# EAGLE design main (EAGLE 9.6.2)
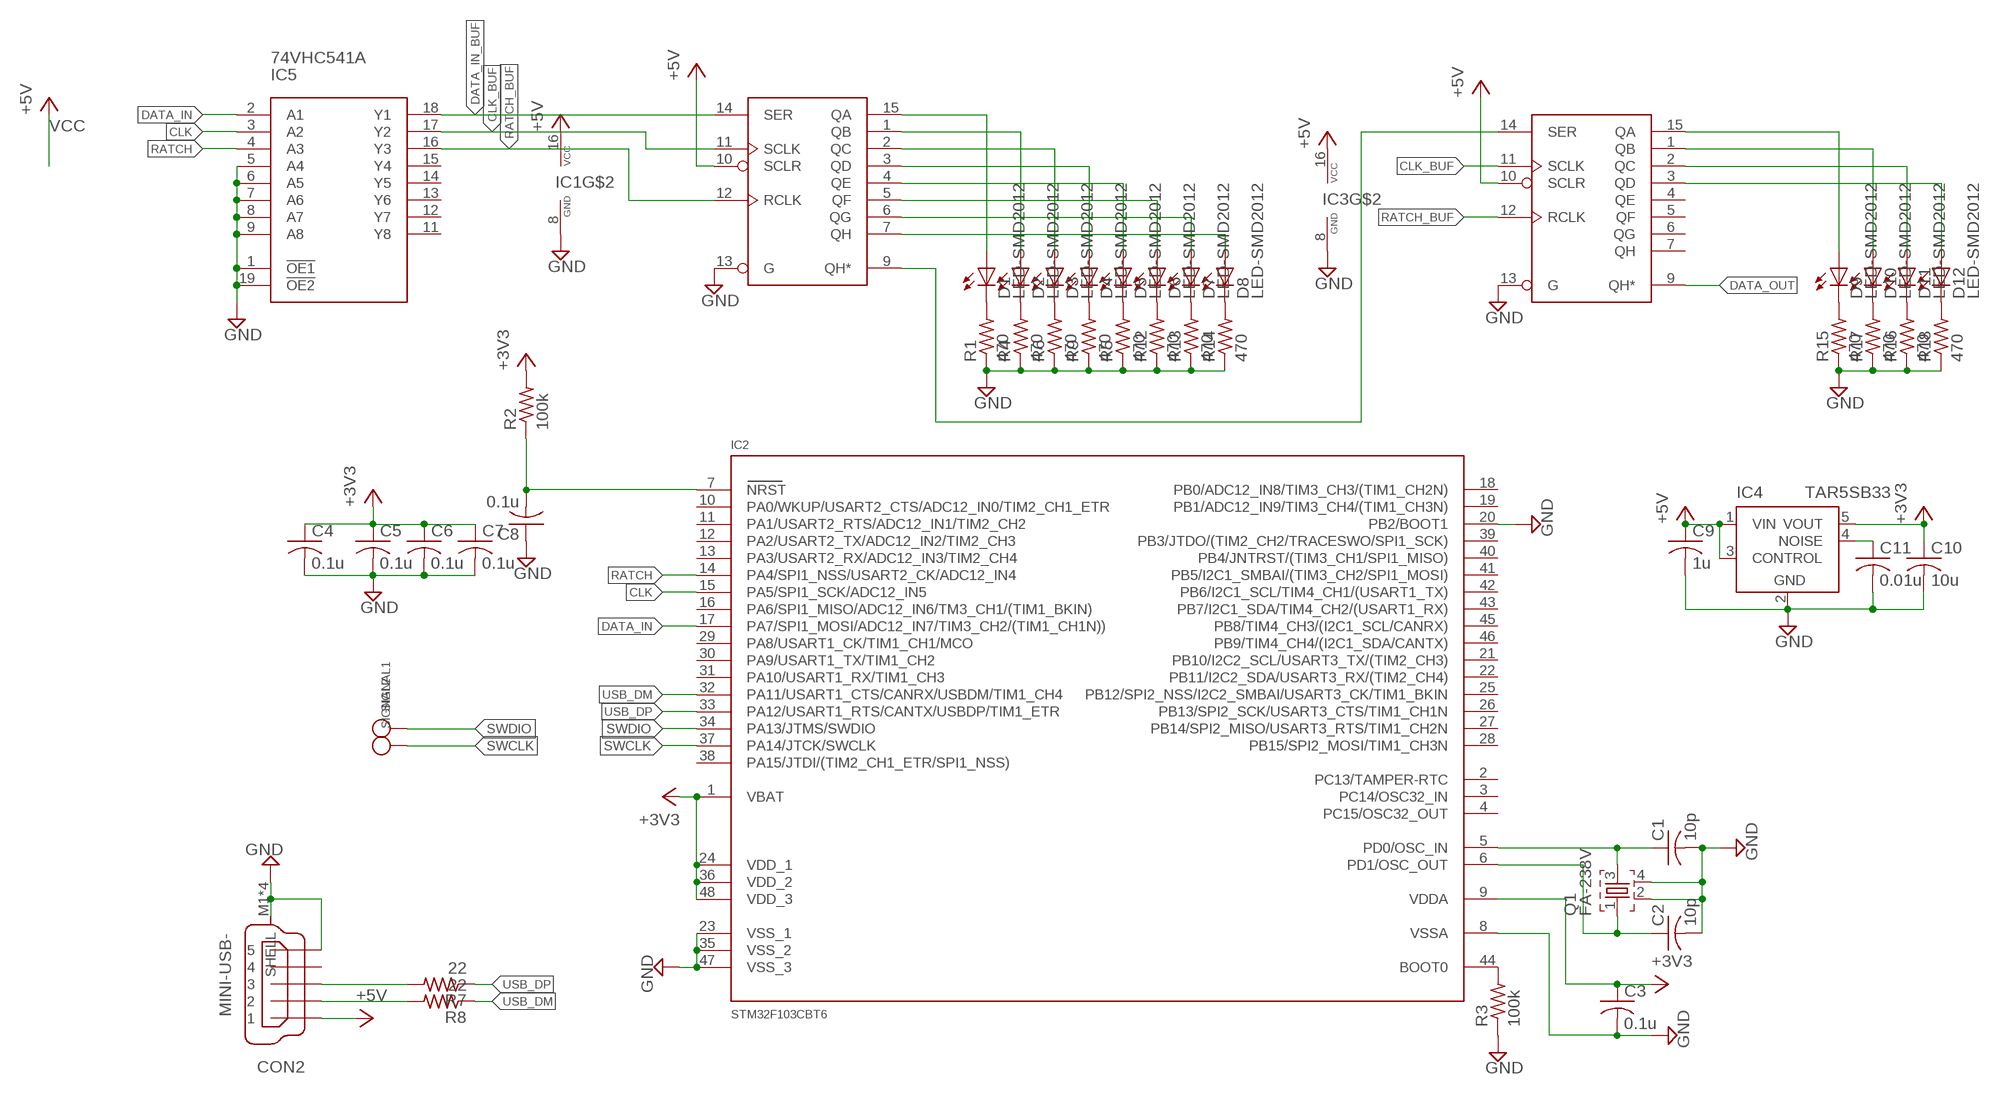
[diagram p0: schematic, sheet 1]

## Parts
C1  10p  C-1608  [1608]
C2  10p  C-1608  [1608]
C3  0.1u  C-2012  [2012-C]
C4  0.1u  C-2012  [2012-C]
C5  0.1u  C-2012  [2012-C]
C6  0.1u  C-2012  [2012-C]
C7  0.1u  C-2012  [2012-C]
C8  0.1u  C-2012  [2012-C]
C9  1u  C-2012  [2012-C]
C10  10u  C-2012  [2012-C]
C11  0.01u  C-2012  [2012-C]
CON2  MINI-USB-  [UX60A-MB-5ST]
D1  LED-SMD2012  [D2012]
D2  LED-SMD2012  [D2012]
D3  LED-SMD2012  [D2012]
D4  LED-SMD2012  [D2012]
D5  LED-SMD2012  [D2012]
D6  LED-SMD2012  [D2012]
D7  LED-SMD2012  [D2012]
D8  LED-SMD2012  [D2012]
D9  LED-SMD2012  [D2012]
D10  LED-SMD2012  [D2012]
D11  LED-SMD2012  [D2012]
D12  LED-SMD2012  [D2012]
IC1  74595AP  [SOP16]
IC2  STM32F103CBT6  [LQFP48]
IC3  74595AP  [SOP16]
IC4  TAR5SB33  [SSOP5-P-0.95]
IC5  74VHC541A  [TSSOP20]
Q1  FA-238V  [FA-238V]
R1  470  R-2012  [2012-R]
R2  100k  R-2012  [2012-R]
R3  100k  R-2012  [2012-R]
R4  470  R-2012  [2012-R]
R5  470  R-2012  [2012-R]
R6  470  R-2012  [2012-R]
R7  22  R-2012  [2012-R]
R8  22  R-2012  [2012-R]
R9  470  R-2012  [2012-R]
R12  470  R-2012  [2012-R]
R13  470  R-2012  [2012-R]
R14  470  R-2012  [2012-R]
R15  470  R-2012  [2012-R]
R16  470  R-2012  [2012-R]
R17  470  R-2012  [2012-R]
R18  470  R-2012  [2012-R]
SIGNAL1  CHECK_PIN-SMD_100*60  [SMD_100*60]
SIGNAL2  CHECK_PIN-SMD_100*60  [SMD_100*60]

## Nets
+3V3: C3.1 C4.1 C5.1 C6.1 C7.1 C10.1 IC2.1(VBAT) IC2.9(VDDA) IC2.24(VDD_1) IC2.36(VDD_2) IC2.48(VDD_3) IC4.5(VOUT) R2.2
+5V: C9.1 CON2.1 IC1.10(SCLR) IC1.16(VCC) IC3.10(SCLR) IC3.16(VCC) IC4.1(VIN) IC4.3(CONTROL)
CLK: IC2.15(PA5/SPI1_SCK/ADC12_IN5) IC5.3(A2)
CLK_BUF: IC1.11(SCLK) IC3.11(SCLK) IC5.17(Y2)
DATA_IN: IC2.17(PA7/SPI1_MOSI/ADC12_IN7/TIM3_CH2/(TIM1_CH1N))) IC5.2(A1)
DATA_IN_BUF: IC1.14(SER) IC5.18(Y1)
DATA_OUT: IC3.9(QH*)
GND: C1.2 C2.2 C3.2 C4.2 C5.2 C6.2 C7.2 C8.1 C9.2 C10.2 C11.2 CON2.5 CON2.M1(SHELL) CON2.M2(SHELL) CON2.M3(SHELL) CON2.M4(SHELL) IC1.8(GND) IC1.13(G) IC2.8(VSSA) IC2.20(PB2/BOOT1) IC2.23(VSS_1) IC2.35(VSS_2) IC2.47(VSS_3) IC3.8(GND) IC3.13(G) IC4.2(GND) IC5.1(!OE1) IC5.5(A4) IC5.6(A5) IC5.7(A6) IC5.8(A7) IC5.9(A8) IC5.19(!OE2) Q1.2 Q1.4 R1.1 R3.1 R4.1 R5.1 R6.1 R9.1 R12.1 R13.1 R14.1 R15.1 R16.1 R17.1 R18.1
N$1: D1.K R1.2
N$2: C1.1 IC2.5(PD0/OSC_IN) Q1.3
N$3: C2.1 IC2.6(PD1/OSC_OUT) Q1.1
N$4: C8.2 IC2.7(NRST) R2.1
N$5: IC2.44(BOOT0) R3.2
N$6: D5.K R5.2
N$7: D2.K R4.2
N$8: D3.K R6.2
N$9: CON2.2 R8.2
N$10: C11.1 IC4.4(NOISE)
N$11: CON2.3 R7.2
N$12: D4.K R9.2
N$13: D6.K R12.2
N$14: D7.K R13.2
N$15: D8.K R14.2
N$16: D1.A IC1.15(QA)
N$17: D2.A IC1.1(QB)
N$18: D3.A IC1.2(QC)
N$19: D4.A IC1.3(QD)
N$20: D5.A IC1.4(QE)
N$21: D6.A IC1.5(QF)
N$22: D7.A IC1.6(QG)
N$23: D8.A IC1.7(QH)
N$24: D9.K R15.2
N$25: D10.K R17.2
N$26: D11.K R16.2
N$27: D12.K R18.2
N$28: D9.A IC3.15(QA)
N$29: D10.A IC3.1(QB)
N$30: D11.A IC3.2(QC)
N$31: D12.A IC3.3(QD)
N$32: IC1.9(QH*) IC3.14(SER)
RATCH: IC2.14(PA4/SPI1_NSS/USART2_CK/ADC12_IN4) IC5.4(A3)
RATCH_BUF: IC1.12(RCLK) IC3.12(RCLK) IC5.16(Y3)
SWCLK: IC2.37(PA14/JTCK/SWCLK) SIGNAL2.SIGNAL
SWDIO: IC2.34(PA13/JTMS/SWDIO) SIGNAL1.SIGNAL
USB_DM: IC2.32(PA11/USART1_CTS/CANRX/USBDM/TIM1_CH4) R8.1
USB_DP: IC2.33(PA12/USART1_RTS/CANTX/USBDP/TIM1_ETR) R7.1
Unconnected: CON2.4 IC2.2(PC13/TAMPER-RTC) IC2.3(PC14/OSC32_IN) IC2.4(PC15/OSC32_OUT) IC2.10(PA0/WKUP/USART2_CTS/ADC12_IN0/TIM2_CH1_ETR) IC2.11(PA1/USART2_RTS/ADC12_IN1/TIM2_CH2) IC2.12(PA2/USART2_TX/ADC12_IN2/TIM2_CH3) IC2.13(PA3/USART2_RX/ADC12_IN3/TIM2_CH4) IC2.16(PA6/SPI1_MISO/ADC12_IN6/TM3_CH1/(TIM1_BKIN)) IC2.18(PB0/ADC12_IN8/TIM3_CH3/(TIM1_CH2N)) IC2.19(PB1/ADC12_IN9/TIM3_CH4/(TIM1_CH3N)) IC2.21(PB10/I2C2_SCL/USART3_TX/(TIM2_CH3)) IC2.22(PB11/I2C2_SDA/USART3_RX/(TIM2_CH4)) IC2.25(PB12/SPI2_NSS/I2C2_SMBAI/USART3_CK/TIM1_BKIN) IC2.26(PB13/SPI2_SCK/USART3_CTS/TIM1_CH1N) IC2.27(PB14/SPI2_MISO/USART3_RTS/TIM1_CH2N) IC2.28(PB15/SPI2_MOSI/TIM1_CH3N) IC2.29(PA8/USART1_CK/TIM1_CH1/MCO) IC2.30(PA9/USART1_TX/TIM1_CH2) IC2.31(PA10/USART1_RX/TIM1_CH3) IC2.38(PA15/JTDI/(TIM2_CH1_ETR/SPI1_NSS)) IC2.39(PB3/JTDO/(TIM2_CH2/TRACESWO/SPI1_SCK)) IC2.40(PB4/JNTRST/(TIM3_CH1/SPI1_MISO)) IC2.41(PB5/I2C1_SMBAI/(TIM3_CH2/SPI1_MOSI)) IC2.42(PB6/I2C1_SCL/TIM4_CH1/(USART1_TX)) IC2.43(PB7/I2C1_SDA/TIM4_CH2/(USART1_RX)) IC2.45(PB8/TIM4_CH3/(I2C1_SCL/CANRX)) IC2.46(PB9/TIM4_CH4/(I2C1_SDA/CANTX)) IC3.4(QE) IC3.5(QF) IC3.6(QG) IC3.7(QH) IC5.11(Y8) IC5.12(Y7) IC5.13(Y6) IC5.14(Y5) IC5.15(Y4)

## Power pins joined to a net without a drawn wire
+5V: IC5.20(VCC)
GND: IC5.10(GND)

## Library data of the parts
C1-C11 = Passive_Robotech:C
CON2 = Connector_Robotech:MINI-USB-: MINI USB Connector Source: http://www.hirose.co.jp/cataloge_hp/e24000019.pdf
D1-D12 = Diode_Robotech:LED
IC1 IC3 = IC_Robotech:74*595AP
IC2 = MicroControler_Robotech:STM32F103CBT: STM32 Medium-density microcontroller STM32F103CBT6 - -40 to 85? STM32F103CBT7 - -40 to 105?
IC4 = IC_Robotech:TAR5SB: Voltage Regulator max 200mA. Pin assignment differs from TAR5S*
IC5 = IC_Robotech:74*541
Q1 = Passive_Robotech:FA-: MHz RANGE CRYSTAL UNIT Source: Epson Toyocom
R1-R9 R12-R18 = Passive_Robotech:R
SIGNAL1 SIGNAL2 = Connector_Robotech:CHECK_PIN

## Board
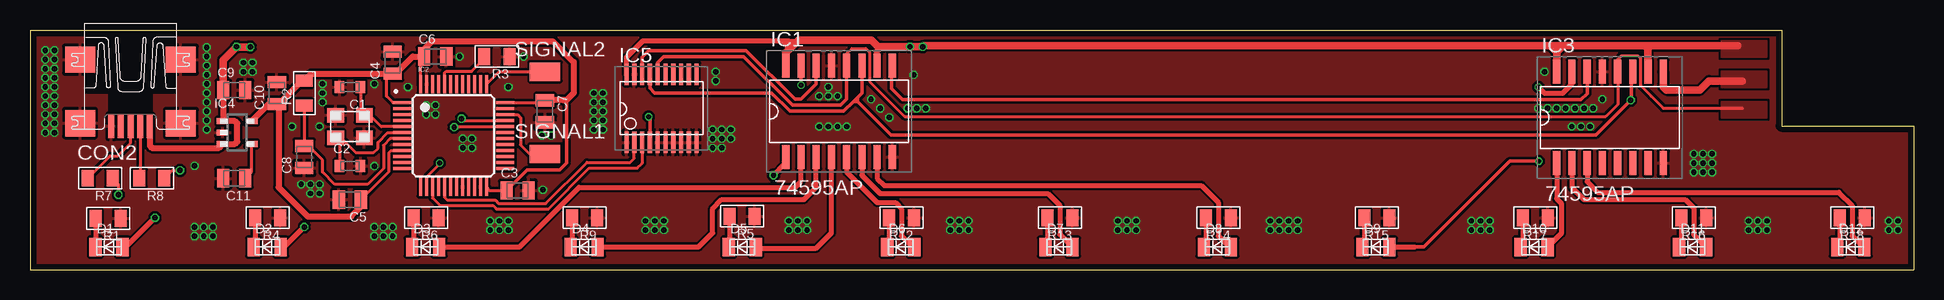
[diagram p1: board, top side]
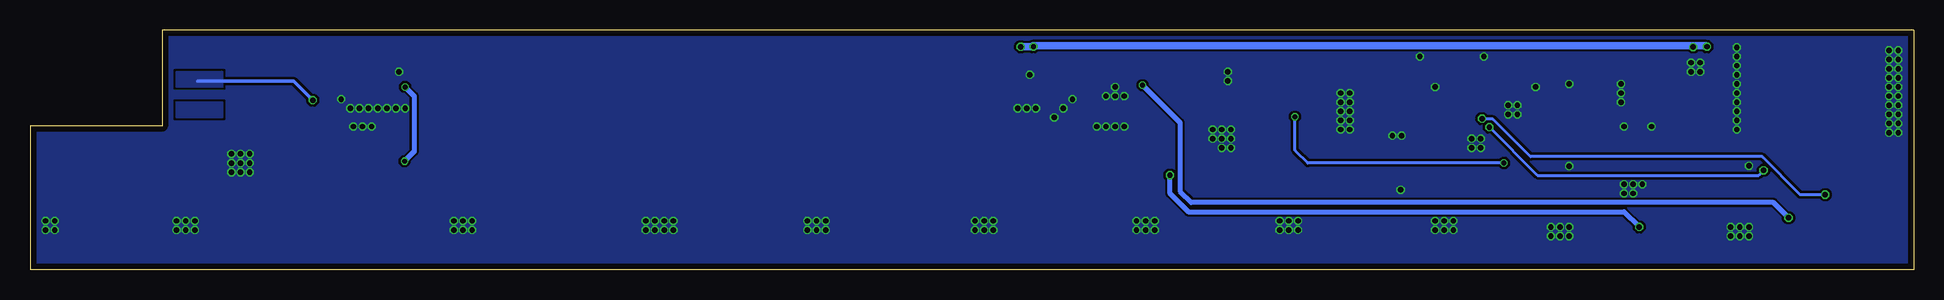
[diagram p2: board, bottom side, seen from below]

Size 157 x 20 mm. Coordinates in mm from the lower left corner, seen from the top.
Outline: 0,0 157,0 157,12 146,12 146,20 0,20 0,0
Copper layers (1*16): Top 0.07mm / dielectric 1.6mm / Bottom 0.07mm
Design rules "pcbcart2layer": minimum track width 6mil, minimum drill 0.4mm, track to track 0.2mm, track to pad 0.2mm, pad to pad 0.2mm, via to via 0.2mm, smd to smd 0.2mm, copper to edge 0.5mm, drill to drill 0.3mm, minimum pad ring 3mil, minimum via ring 3mil, stop-mask expansion 1mil, vias tented up to drill 1mm, thermal gap 10mil

### Footprints (pad centres in the part's own frame; a part is rotated, then mirrored left to right if it is on the bottom)
1608 = smd 0.762 x 1.016: 1 -0.875,0; 2 0.875,0
2012-C = smd 1.016 x 1.524: 1 -0.921,0; 2 0.921,0
UX60A-MB-5ST = smd 2 x 0.5: 1 2.25,1.6; 2 2.25,0.8; 3 2.25,0; 4 2.25,-0.8; 5 2.25,-1.6 | smd 2.2 x 2.5: M1 -3.3,-4.2; M2 -3.3,4.2; M3 2,4.2; M4 2,-4.2
D2012 = smd 1.016 x 1.524: A 1.127,0; K -1.127,0
SOP16 = smd 0.6 x 2: 1 0,0; 2 1.27,0; 3 2.54,0; 4 3.81,0; 5 5.08,0; 6 6.35,0; 7 7.62,0; 8 8.89,0; 9 8.89,7.62; 10 7.62,7.62; 11 6.35,7.62; 12 5.08,7.62; 13 3.81,7.62; 14 2.54,7.62; 15 1.27,7.62; 16 0,7.62
LQFP48 = smd 1.5 x 0.25: 1 -4.3,2.75; 2 -4.3,2.25; 3 -4.3,1.75; 4 -4.3,1.25; 5 -4.3,0.75; 6 -4.3,0.25; 7 -4.3,-0.25; 8 -4.3,-0.75; 9 -4.3,-1.25; 10 -4.3,-1.75; 11 -4.3,-2.25; 12 -4.3,-2.75; 25 4.3,-2.75; 26 4.3,-2.25; 27 4.3,-1.75; 28 4.3,-1.25; 29 4.3,-0.75; 30 4.3,-0.25; 31 4.3,0.25; 32 4.3,0.75; 33 4.3,1.25; 34 4.3,1.75; 35 4.3,2.25; 36 4.3,2.75 | smd 0.25 x 1.5: 13 -2.75,-4.3; 14 -2.25,-4.3; 15 -1.75,-4.3; 16 -1.25,-4.3; 17 -0.75,-4.3; 18 -0.25,-4.3; 19 0.25,-4.3; 20 0.75,-4.3; 21 1.25,-4.3; 22 1.75,-4.3; 23 2.25,-4.3; 24 2.75,-4.3; 37 2.75,4.3; 38 2.25,4.3; 39 1.75,4.3; 40 1.25,4.3; 41 0.75,4.3; 42 0.25,4.3; 43 -0.25,4.3; 44 -0.75,4.3; 45 -1.25,4.3; 46 -1.75,4.3; 47 -2.25,4.3; 48 -2.75,4.3
SSOP5-P-0.95 = smd 0.5 x 1: 1 -0.95,-1.2; 2 0,-1.2; 3 0.95,-1.2; 4 0.95,1.2; 5 -0.95,1.2
TSSOP20 = smd 0.35 x 1.8: 1 -2.857,-2.84; 2 -2.208,-2.84; 3 -1.558,-2.84; 4 -0.907,-2.84; 5 -0.258,-2.84; 6 0.393,-2.84; 7 1.042,-2.84; 8 1.692,-2.84; 9 2.342,-2.84; 10 2.993,-2.84; 11 2.993,2.84; 12 2.342,2.84; 13 1.692,2.84; 14 1.042,2.84; 15 0.393,2.84; 16 -0.258,2.84; 17 -0.907,2.84; 18 -1.558,2.84; 19 -2.208,2.84; 20 -2.857,2.84
FA-238V = smd 1.4 x 1.2: 1 -1.2,-0.95; 2 1.2,-0.95; 3 1.2,0.95; 4 -1.2,0.95
2012-R = smd 1 x 1.4: 1 -1.048,0; 2 1.048,0
SMD_100*60 = smd 2.54 x 1.524: SIGNAL 0,0

### Placement (x,y rotation side)
C1  26.67,15.24 180 top
C2  26.67,8.64 0 top
C3  40.64,6.6 0 top
C4  30.23,17.27 90 top
C5  26.67,5.84 180 top
C6  33.78,17.78 0 top
C7  42.93,13.21 270 top
C8  22.86,9.4 90 top
C9  17.02,14.99 0 top
C10  20.57,14.73 90 top
C11  17.02,7.62 180 top
CON2  8.38,14.22 270 top
D1  6.58,1.88 0 top
D2  19.78,1.88 0 top
D3  32.98,1.88 0 top
D4  46.18,1.88 0 top
D5  59.38,1.88 0 top
D6  72.58,1.88 0 top
D7  85.78,1.88 0 top
D8  98.98,1.88 0 top
D9  112.18,1.88 0 top
D10  125.38,1.88 0 top
D11  138.58,1.88 0 top
D12  151.78,1.88 0 top
IC1  62.99,9.4 0 top
IC2  35.31,11.18 0 top
IC3  127.25,8.89 0 top
IC4  17.27,11.43 270 top
IC5  52.58,13.46 0 top
Q1  26.67,11.94 0 top
R1  6.52,4.27 180 top
R2  22.86,14.73 90 top
R3  38.91,17.78 180 top
R4  19.81,4.32 180 top
R5  59.35,4.44 180 top
R6  33.02,4.32 180 top
R7  5.84,7.62 180 top
R8  10.16,7.62 180 top
R9  46.23,4.32 180 top
R12  72.64,4.32 180 top
R13  85.85,4.32 180 top
R14  99.06,4.32 180 top
R15  112.27,4.32 180 top
R16  138.68,4.32 180 top
R17  125.48,4.32 180 top
R18  151.89,4.32 180 top
SIGNAL1  42.93,9.65 0 top
SIGNAL2  42.93,16.51 0 top

### Tracks (layer width: path | path; a pad name or v marks a point on that pad's centre or on a via)
+3V3
  Top 0.254: C5.1 29.92,8.17 29.92,9.76 30.08,9.93 IC2.9 | IC2.1 30.27,13.93 29.72,14.48 29.72,15.84 C4.1 | IC2.48 32.56,17.48 C6.1 | IC2.36 42.72,13.93 C7.1 | IC2.24 38.33,6.6 C3.1
  Top 0.305: C3.1 41.45,8.33 44.15,8.33 44.71,8.9 44.71,13.87 | 44.71,13.87 44.71,14.13 | 44.45,14.13 44.71,13.87
  Top 0.508: IC4.5 19.9,13.81 C10.1 | C10.1 20.73,13.66 20.73,6.86 23.16,4.42 26.77,4.42 27.59,5.24 C5.1 | C10.1 20.73,13.81 22.7,15.78 R2.2 23.43,16.35 C4.1 30.48,16.35 31.91,17.78 C6.1 32.86,18.38 33.53,19.05 43.59,19.05 45.31,17.32 45.31,14.73 44.71,14.13 44.45,14.13 C7.1
+5V  (via drill 0.45)
  Top 0.254: 63.2,19.1 63.25,19.15 64.06,19.15 | 63.02,18.82 63.02,18.11 62.99,18.09
  Top 0.406: IC5.20 49.72,17.72 51.1,19.1 62.74,19.1 | 62.74,19.1 63.2,19.1 63.6,18.69 | 62.74,19.1 63.02,18.82 63.22,18.61 63.22,18.31
  Top 0.508: CON2.1 9.98,10.34 10.16,10.16 15.75,10.16 IC4.3 17.08,10.48 17.27,10.67 17.27,12.19 17.08,12.38 IC4.1 16.1,12.4 C9.1 | IC1.10 70.61,18.29 70.8,18.48
  Top 0.61: IC3.10 134.87,18.43 | 134.62,18.68 134.87,18.43 | 127.8,18.68 134.62,18.68 | 127.8,18.68 127.36,18.68 | 127.36,18.68 126.71,18.68 | C9.1 16.1,17.48 v17.22,18.61 17.26,18.57 v18.36,18.57 | IC1.16 62.99,18.09 63.22,18.31 63.6,18.69 64.06,19.15 70.13,19.15 70.8,18.48 70.93,18.61 v73.36,18.61 74.44,18.61 | IC3.16 127.25,18.14 | 127.25,18.14 127.25,18.58 127.36,18.68 | 127.25,18.14 127.8,18.68 | 127.25,18.14 126.71,18.68 | 134.62,18.68 135.13,18.68 | 135.13,18.68 142.36,18.68 | 134.87,18.43 135.13,18.68 | 126.71,18.68 74.51,18.68 74.44,18.61 | 74.44,18.61 v74.42,18.59
  Bottom 0.61: v17.22,18.61 17.3,18.68 73.41,18.68 73.41,18.66 | 73.41,18.66 v73.36,18.61 | v74.42,18.59 73.47,18.59 73.41,18.66
  pour Top: 140.97,19.05 140.97,17.78 144.78,17.78 144.78,19.05
CLK
  Top 0.254: IC2.15 33.56,5.97 34.18,5.34 38.6,5.34 38.89,5.06 43.21,5.06 46.61,8.46 50.62,8.46 51.03,8.87 51.02,8.87 IC5.3
CLK_BUF  (via drill 0.45)
  Top 0.305: IC5.17 51.67,15.13 52.07,14.73 61.82,14.73 63.34,13.21 67.82,13.21 68.65,14.03 | IC1.11 69.34,14.73 68.97,14.36 | 68.65,14.03 68.81,14.2 | 68.81,14.2 68.97,14.36 | IC3.11 133.49,16.4 133.49,14.2 v133.43,14.14 130.54,11.25 71.76,11.25 68.97,14.03 | 68.97,14.03 68.81,14.2 | 68.97,14.36 68.97,14.03 | 68.65,14.03 68.97,14.03
  Bottom 0.305: v133.43,14.14 135.04,15.75 143,15.75
  pour Bottom: 140.97,16.51 140.97,15.24 144.78,15.24 144.78,16.51
DATA_IN
  Top 0.254: IC2.17 34.56,6.03 34.79,5.8 38.79,5.8 39.08,5.51 43,5.51 46.42,8.94 50.04,8.94 50.37,9.27 IC5.2
DATA_IN_BUF
  Top 0.305: IC1.14 65.53,15.49 64.26,14.22 63.75,14.22 59.69,18.29 51.56,18.29 51.02,17.75 IC5.18
DATA_OUT
  Top 0.61: IC3.9 136.14,15.24 136.4,14.99 139.19,14.99 139.95,15.75 142.75,15.75
  pour Top: 140.97,16.51 140.97,15.24 144.78,15.24 144.78,16.51
GND  (via drill 0.45)
  other vias: 1.27,18.29 1.27,17.53 1.27,16.76 1.27,16 1.27,15.24 1.27,14.48 1.27,13.72 14.73,18.54 14.73,17.78 14.73,17.02 14.73,16.26 14.73,15.49 14.73,14.73 14.73,13.97 14.73,13.21 42.67,11.18 43.43,11.18 38.35,4.06 39.12,4.06 38.35,3.3 39.12,3.3 39.88,3.3 39.88,4.06 22.61,7.11 23.37,7.11 24.13,7.11 23.37,6.35 24.13,6.35 24.38,15.49 24.38,14.73 24.38,13.97 24.13,11.94 21.84,11.94 13.72,3.56 14.48,3.56 15.24,3.56 13.72,2.79 14.48,2.79 15.24,2.79 28.7,2.79 29.46,2.79 30.23,2.79 28.7,3.56 29.46,3.56 30.23,3.56 51.31,3.3 52.07,3.3 52.83,3.3 51.31,4.06 52.07,4.06 52.83,4.06 63.25,4.06 64.01,4.06 64.77,4.06 63.25,3.3 64.01,3.3 64.77,3.3 76.71,4.06 77.47,4.06 78.23,4.06 76.71,3.3 77.47,3.3 78.23,3.3 90.68,4.06 91.44,4.06 92.2,4.06 90.68,3.3 91.44,3.3 92.2,3.3 103.38,4.06 104.14,4.06 104.9,4.06 105.66,4.06 103.38,3.3 104.14,3.3 104.9,3.3 105.66,3.3 143.26,4.06 144.02,4.06 144.78,4.06 143.26,3.3 144.02,3.3 144.78,3.3 120.14,4.06 120.9,4.06 121.67,4.06 120.14,3.3 120.9,3.3 121.67,3.3 130.3,13.46 129.54,13.46 128.78,13.46 131.06,14.22 128.02,13.46 73.66,16.26 126.24,16.51 35.81,17.78 41.15,17.78 28.7,8.64 13.72,8.66 154.94,4.06 154.94,3.3 155.7,4.06 155.7,3.3 127.25,13.46 126.49,13.46 125.73,13.46 73.15,13.46 73.91,13.46 74.68,13.46 65.79,11.94 66.55,11.94 67.31,11.94 68.07,11.94 128.52,11.94 129.29,11.94 130.05,11.94 1.27,12.95 1.27,12.19 1.27,11.43 2.03,18.29 2.03,17.53 2.03,16.76 2.03,16 2.03,15.24 2.03,14.48 2.03,13.72 2.03,12.95 2.03,12.19 2.03,11.43 14.73,12.45 14.73,11.68 17.78,17.27 18.54,17.27 17.78,16.51 18.54,16.51 28.7,15.49 31.5,15.24 39.88,15.24 46.99,14.73 46.99,13.97 46.99,13.21 46.99,12.45 46.99,11.68 47.75,14.73 47.75,13.97 47.75,13.21 47.75,12.45 47.75,11.68 56.9,11.68 56.9,10.92 56.9,10.16 57.66,10.16 57.66,10.92 57.66,11.68 58.42,11.68 58.42,10.92 57.15,16.51 57.15,15.75 36.07,10.16 36.83,10.16 36.07,10.92 36.83,10.92 33.02,13.72 33.02,12.95 33.78,12.95 33.78,13.72 65.79,14.48 66.55,14.48 67.31,14.48 66.55,15.24 70.1,14.22 70.87,13.46 71.63,12.7 42.75,6.65 138.68,9.65 138.68,8.89 138.68,8.13 139.45,8.13 139.45,8.89 139.45,9.65 140.21,9.65 140.21,8.89 140.21,8.13
  pour Top (rank 2): 0,0 0,20 146,20 146,12 157,12 157,0
  pour Bottom (rank 2): 157,12 146,12 146,20 0,20 0,0 157,0
  pour Bottom: 140.97,19.05 140.97,17.78 144.78,17.78 144.78,19.05
N$1
  Top 0.406: R1.2 5.47,1.88 D1.K
N$2
  Top 0.254: IC2.5 29.27,11.93 28.31,12.89 Q1.3 27.55,13.21 C1.1
N$3
  Top 0.254: IC2.6 29.81,11.43 29,10.62 29,10.12 28.64,9.75 27.16,9.75 25.92,10.99 Q1.1 25.8,10.66 C2.1
N$4
  Top 0.254: IC2.7 30.03,10.93 29.46,10.36 29.46,8.43 28.14,7.11 25.4,7.11 24.38,8.13 24.38,9.14 23.21,10.32 C8.2 R2.1
N$5
  Top 0.254: IC2.44 34.56,16.42 34.7,16.56 36.02,16.56 36.02,16.55 36.83,16.55 37.87,17.59 R3.2
N$6
  Top 0.406: R5.2 58.3,1.88 D5.K
N$7
  Top 0.406: R4.2 18.76,1.88 D2.K
N$8
  Top 0.406: R6.2 31.97,1.88 D3.K
N$9
  Top 0.254: CON2.2 9.18,7.69 R8.2
N$10
  Top 0.254: C11.1 18.47,8.15 IC4.4
N$11
  Top 0.254: R7.2 6.67,9.5 7.32,9.5 8.38,10.57 CON2.3
N$12
  Top 0.406: R9.2 45.18,1.88 D4.K
N$13
  Top 0.406: R12.2 71.6,1.88 D6.K
N$14
  Top 0.406: R13.2 84.8,1.88 D7.K
N$15
  Top 0.406: R14.2 98.01,1.88 D8.K
N$16  (via drill 0.4, 0.45)
  Top 0.305: IC1.15 v64.26,15.38
  Top 0.406: D1.A 7.98,1.88 v10.41,4.32
  Bottom 0.406: v10.41,4.32 11.68,5.59 60.2,5.59 61.14,6.53 61.14,12.26 v64.26,15.38
N$17  (via drill 0.45)
  Top 0.406: D2.A 21.18,1.88 v22.86,3.56 | v61.98,7.87 62.99,8.89 IC1.1
  Bottom 0.406: v22.86,3.56 24.13,4.83 60.45,4.83 61.98,6.35 v61.98,7.87
N$18
  Top 0.406: D3.A 40.79,1.88 45.77,6.86 63.75,6.86 64.26,7.37 IC1.2
N$19
  Top 0.406: D4.A 55.73,1.88 56.9,3.05 56.9,5.08 57.66,5.84 64.52,5.84 65.53,6.86 IC1.3
N$20
  Top 0.406: D5.A 60.61,1.78 65.53,1.78 66.8,3.05 IC1.4
N$21
  Top 0.406: IC1.5 68.07,8.13 70.61,5.59 72.14,5.59 72.64,5.08 72.64,2.79 73.56,1.88 D6.A
N$22
  Top 0.406: IC1.6 69.34,7.87 70.87,6.35 84.84,6.35 85.85,5.33 85.85,2.93 D7.A
N$23
  Top 0.406: IC1.7 70.61,7.62 71.22,7.01 97.64,7.01 99.06,5.59 99.06,2.79 99.97,1.88 D8.A
N$24
  Top 0.406: R15.2 111.22,1.88 D9.K
N$25
  Top 0.406: R17.2 124.43,1.88 D10.K
N$26
  Top 0.406: R16.2 137.64,1.88 D11.K
N$27
  Top 0.406: R18.2 150.84,1.88 D12.K
N$28  (via drill 0.4)
  Top 0.305: 115.42,1.88 116.2,1.88 123.37,9.04 v125.78,9.04
  Top 0.406: D9.A 115.42,1.88 | v125.73,15.24 126.24,14.73 127.76,14.73 128.52,15.49 IC3.15
  Bottom 0.406: v125.73,15.24 124.97,14.48 124.97,9.86 v125.78,9.04
N$29
  Top 0.406: D10.A 127.63,3.01 127.63,5.52 127.25,5.9 IC3.1
N$30
  Top 0.406: IC3.2 128.52,6.86 129.54,5.84 137.97,5.84 138.68,5.13 138.68,2.9 D11.A
N$31
  Top 0.406: IC3.3 129.79,7.32 130.66,6.45 150.77,6.45 151.89,5.33 151.89,2.79 152.81,1.88 D12.A
N$32
  Top 0.305: IC3.14 129.79,14.68 129.29,14.17 72.75,14.17 71.83,15.09 71.83,16.97 IC1.9
NC
  pour Bottom: 140.97,13.97 140.97,12.7 144.78,12.7 144.78,13.97
RATCH  (via drill 0.4)
  Top 0.254: IC2.14 33.1,6.92 33.1,7.76 34.14,8.79 v34.14,8.89
  Top 0.305: v51.56,12.75 51.67,12.64 IC5.4
  Bottom 0.254: v34.14,8.89 50.49,8.89 51.56,9.96 v51.56,12.75
RATCH_BUF
  Top 0.254: IC1.12 68.07,18.01 68.5,18.44 69.68,18.44 69.98,18.14 69.98,15.69 72.9,12.77 131.35,12.77 132.33,13.76 IC3.12 132.33,17.53 132.65,17.84 134.04,17.84 134.24,17.63 134.24,15.38 135.13,14.49 135.13,14.48 136.14,13.46 142.75,13.46
  Top 0.305: IC1.12 68.07,14.22 67.56,13.72 63.55,13.72 59.48,17.78 52.83,17.78 52.32,17.27 IC5.16
  pour Top: 140.97,13.97 140.97,12.7 144.78,12.7 144.78,13.97
SWCLK
  Top 0.254: IC2.37 39.09,16.51 SIGNAL2.SIGNAL
SWDIO
  Top 0.254: IC2.34 40.67,12.93 40.89,12.7 40.89,10.41 41.66,9.65 SIGNAL1.SIGNAL
USB_DM  (via drill 0.45)
  Top 0.254: R8.1 11.87,8.28 v12.5,8.28 | v35.36,11.89 35.4,11.93 IC2.32
  Bottom 0.254: v12.5,8.28 12.9,7.87 31.34,7.87 v35.36,11.89
USB_DP  (via drill 0.45)
  Top 0.254: R7.1 7.37,7.14 v7.37,6.25 | v35.97,12.59 36.13,12.43 IC2.33
  Bottom 0.254: v7.37,6.25 9.45,6.25 12.62,9.42 31.93,9.42 35.06,12.55 35.93,12.55 v35.97,12.59

### Text on the board
tValues: SWCLK | Uplight | SWDIO